# EAGLE design Nano-CC-EL_0v6.2_ENP252-17 (EAGLE 7.3.0)
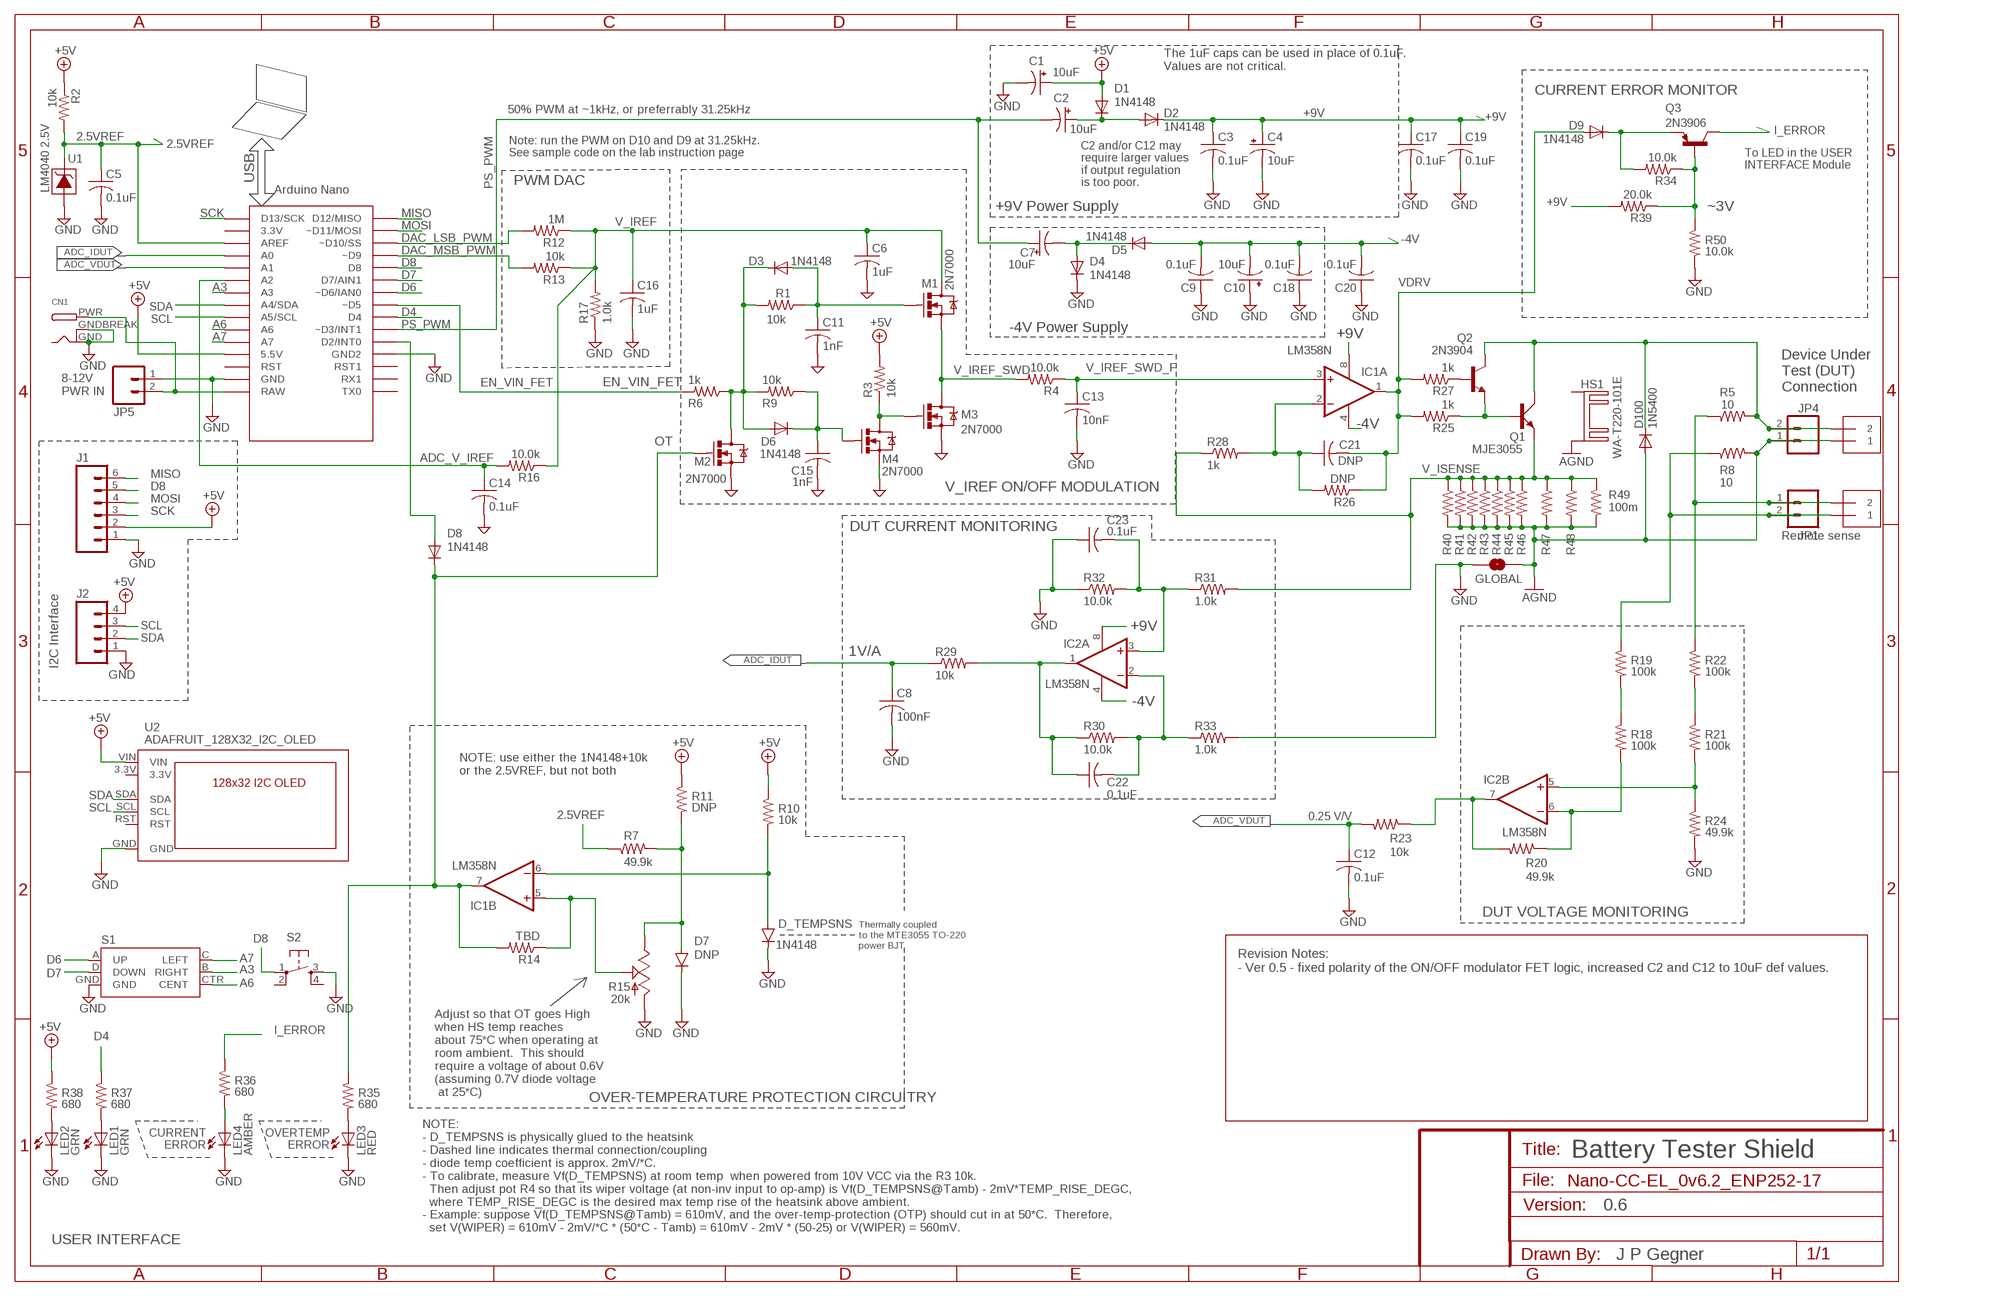
[diagram p0: schematic, sheet 1]

## Parts
C1  10uF  CPOL-USE5-5  [E5-5]
C2  10uF  CPOL-USE5-5  [E5-5]
C3  0.1uF  C-US025-025X050  [C025-025X050]
C4  10uF  CPOL-USE5-5  [E5-5]
C5  0.1uF  C-US025-025X050  [C025-025X050]
C6  1uF  C-US025-025X050  [C025-025X050]
C7  10uF  CPOL-USE5-5  [E5-5]
C8  100nF  C-US025-024X044  [C025-024X044]
C9  0.1uF  C-US025-025X050  [C025-025X050]
C10  10uF  CPOL-USE5-5  [E5-5]
C11  1nF  C-US025-025X050  [C025-025X050]
C12  0.1uF  C-US025-025X050  [C025-025X050]
C13  10nF  C-US025-025X050  [C025-025X050]
C14  0.1uF  C-US025-025X050  [C025-025X050]
C15  1nF  C-US025-025X050  [C025-025X050]
C16  1uF  C-US025-025X050  [C025-025X050]
C17  0.1uF  C-US025-025X050  [C025-025X050]
C18  0.1uF  C-US025-025X050  [C025-025X050]
C19  0.1uF  C-US025-025X050  [C025-025X050]
C20  0.1uF  C-US025-025X050  [C025-025X050]
C21  DNP  C-US025-025X050  [C025-025X050]
C22  0.1uF  C-US025-025X050  [C025-025X050]
C23  0.1uF  C-US025-025X050  [C025-025X050]
CN1  DCBARRELPTH  [DCJACK_2MM_PTH]
D1  1N4148  [0207/2V-D]
D2  1N4148  [0207/2V-D]
D3  1N4148  [0207/2V-D]
D4  1N4148  [0207/2V-D]
D5  1N4148  [0207/2V-D]
D6  1N4148  [0207/2V-D]
D7  DNP  1N4148  [0207/2V-D]
D8  1N4148  [0207/2V-D]
D9  1N4148  [0207/2V-D]
D100  1N5400  [DO201-15]
D_TEMPSNS  1N4148  [0207/2V-D]
GLOBAL  JUMPER-PAD-2-NC_BY_TRACENO_SILK  [PAD-JUMPER-2-NC_BY_TRACE_NO_SILK]
HS1  WA-T220-101E  [WX-T220-101E]
IC1  LM358N  [DIL08]
IC2  LM358N  [DIL08]
J1  M06POLAR  [MOLEX-1X6]
J2  M04LOCK_LONGPADS  [1X04_LOCK_LONGPADS]
JP1  M02PTH  [1X02]
JP2  1X2-3.5MM  [1X2-3.5MM]
JP3  1X2-3.5MM  [1X2-3.5MM]
JP4  M02PTH  [1X02]
JP5  M02PTH  [1X02]
LED1  GRN  LED-3MM-NO_SILK  [LED3MM-NS]
LED2  GRN  LED-3MM-NO_SILK  [LED3MM-NS]
LED3  RED  LED-3MM-NO_SILK  [LED3MM-NS]
LED4  AMBER  LED-3MM-NO_SILK  [LED3MM-NS]
M1  2N7000  MOSFET-NCHANNEL2N7000  [TO-92]
M2  2N7000  MOSFET-NCHANNEL2N7000  [TO-92]
M3  2N7000  MOSFET-NCHANNEL2N7000  [TO-92]
M4  2N7000  MOSFET-NCHANNEL2N7000  [TO-92]
Q1  MJE3055  [TO220AV]
Q2  2N3904  [TO92]
Q3  2N3906  [TO92]
R1  10k  R-US_0204/7  [0204/7]
R2  10k  R-US_0204/7  [0204/7]
R3  10k  R-US_0204/7  [0204/7]
R4  10.0k  R-US_0204/2V  [0204V]
R5  10  R-US_0204/2V  [0204V]
R6  1k  R-US_0204/2V  [0204V]
R7  49.9k  R-US_0204/7  [0204/7]
R8  10  R-US_0204/2V  [0204V]
R9  10k  R-US_0204/7  [0204/7]
R10  10k  R-US_0204/7  [0204/7]
R11  DNP  R-US_0204/7  [0204/7]
R12  1M  R-US_0204/7  [0204/7]
R13  10k  R-US_0204/7  [0204/7]
R14  TBD  R-US_0204/7  [0204/7]
R15  20k  TRIM_US-B64Y  [B64Y]
R16  10.0k  R-US_0204/7  [0204/7]
R17  1.0k  R-US_0204/7  [0204/7]
R18  100k  R-US_0204/7  [0204/7]
R19  100k  R-US_0204/7  [0204/7]
R20  49.9k  R-US_0204/2V  [0204V]
R21  100k  R-US_0204/7  [0204/7]
R22  100k  R-US_0204/7  [0204/7]
R23  10k  R-US_0204/7  [0204/7]
R24  49.9k  R-US_0204/7  [0204/7]
R25  1k  R-US_0204/7  [0204/7]
R26  DNP  R-US_0204/2V  [0204V]
R27  1k  R-US_0204/7  [0204/7]
R28  1k  R-US_0204/7  [0204/7]
R29  10k  R-US_0204/7  [0204/7]
R30  10.0k  R-US_0204/2V  [0204V]
R31  1.0k  R-US_0204/7  [0204/7]
R32  10.0k  R-US_0204/7  [0204/7]
R33  1.0k  R-US_0204/7  [0204/7]
R34  10.0k  R-US_0204/7  [0204/7]
R35  680  R-US_0204/7  [0204/7]
R36  680  R-US_0204/7  [0204/7]
R37  680  R-US_0207/15  [0207/15]
R38  680  R-US_0204/7  [0204/7]
R39  20.0k  R-US_0204/7  [0204/7]
R40  100m  R-US_0204/7  [0204/7]
R41  100m  R-US_0204/7  [0204/7]
R42  100m  R-US_0204/7  [0204/7]
R43  100m  R-US_0204/7  [0204/7]
R44  100m  R-US_0204/7  [0204/7]
R45  100m  R-US_0204/7  [0204/7]
R46  100m  R-US_0204/7  [0204/7]
R47  100m  R-US_0204/7  [0204/7]
R48  100m  R-US_0204/7  [0204/7]
R49  100m  R-US_0204/7  [0204/7]
R50  10.0k  R-US_0204/7  [0204/7]
S1  JOYSTICK_MINI  [JOYSTICK_MINI]
S2  E-SWITCH_TL1105L-F250-Q  [OMRON_B3F-1XX-JPGMOD]
U1  LM4040 2.5V  LM4040TO92  [TO92]
U2  ADAFRUIT_128X32_I2C_OLED  [ADAFRUIT_128X32_I2C_OLED]
U$1  NANO  [NANO]

## Nets
2.5VREF: C5.1 R2.2 R7.1 U1.2(CATHODE) U$1.AREF
+5V: C1.+ D1.A J1.2 J2.4 R2.1 R3.2 R10.1 R11.1 R38.1 U2.VIN U$1.5V(5.5V)
+9V: C3.1 C4.+ C17.1 C19.1 D2.K(C) IC1.8(P:V+) IC2.8(P:V+) R39.2
-4V: C9.2 C10.- C18.2 C20.2 D5.A IC1.4(P:V-) IC2.4(P:V-)
A3: S1.B(RIGHT) U$1.A3
A6: S1.CTR(CENT) U$1.A6
A7: S1.C(LEFT) U$1.A7
ADC_IDUT: C8.1 R29.1 U$1.A0
ADC_V_IREF: C14.1 R16.2 U$1.A2
ADC_VDUT: C12.1 R23.2 U$1.A1
AGND: D100.A GLOBAL.2 HS1.K2(K) JP3.1 JP4.1 R8.2 R40.2 R41.2 R42.2 R43.2 R44.2 R45.2 R46.2 R47.2 R48.2 R49.2
D4: R37.1 U$1.D4
D6: S1.A(UP) U$1.D6(~D6/IAN0)
D7: S1.D(DOWN) U$1.D7(D7/AIN1)
D8: J1.5 S2.1(P) U$1.D8
DAC_LSB_PWM: R12.2 U$1.D10(~D10/SS)
DAC_MSB_PWM: R13.2 U$1.D9(~D9)
EN_VIN_FET: R6.2 U$1.D5(~D5)
EN_VIN_FETX: D3.K(C) D6.A M2.3(D) R1.2 R6.1 R9.2
GND: C1.- C3.2 C4.- C5.2 C6.2 C8.2 C9.1 C10.+ C11.2 C12.2 C13.2 C14.2 C15.2 C16.2 C17.2 C18.1 C19.2 C20.1 C23.1 CN1.GND CN1.GNDBREAK D4.K(C) D7.K(C) D_TEMPSNS.K(C) GLOBAL.1 J1.1 J2.1 JP5.1 LED1.K(C) LED2.K(C) LED3.K(C) LED4.K(C) M2.1(S) M3.1(S) M4.1(S) R15.A R17.1 R24.2 R32.1 R33.2 R50.2 S1.GND S2.3(S) U1.3(ANODE) U2.GND U$1.GND U$1.GND1(GND2)
I_ERROR: Q3.1(C) R36.1
MISO: J1.6 U$1.D12(D12/MISO)
MOSI: J1.4 U$1.D11(~D11/MOSI)
N$1: D7.A R7.2 R11.2 R15.E
N$2: R21.1 R22.2
N$3: C23.2 IC2.3(A:+IN) R31.1 R32.2
N$4: C22.2 IC2.2(A:-IN) R30.2 R33.1
N$5: D_TEMPSNS.A IC1.6(B:-IN) R10.2
N$6: IC1.5(B:+IN) R14.1 R15.S
N$8: C11.1 D3.A M1.2(G) R1.1
N$9: D9.K(C) Q3.3(E) R34.2
N$10: IC2.6(B:-IN) R18.2 R20.1
N$11: C7.- D4.A D5.K(C)
N$12: LED3.A R35.2
N$13: LED2.A R38.2
N$14: LED1.A R37.2
N$15: C22.1 IC2.1(A:OUT) R29.2 R30.1
N$16: LED4.A R36.2
N$17: Q3.2(B) R34.1 R39.1 R50.1
N$18: C2.+ D1.K(C) D2.A
N$19: IC2.5(B:+IN) R21.2 R24.1
N$20: C15.1 D6.K(C) M4.2(G) R9.1
N$21: M3.2(G) M4.3(D) R3.1
N$22: JP1.1 JP2.2 R5.1 R22.1
N$23: D8.A U$1.D2(D2/INT0)
N$24: Q2.2(B) R27.1
N$25: D100.C JP3.2 JP4.2 Q1.C Q2.1(C) R5.2
N$26: Q1.B Q2.3(E) R25.1
N$27: R18.1 R19.2
N$28: C21.1 IC1.2(A:-IN) R26.2 R28.2
N$29: JP1.2 JP2.1 R8.1 R19.1
OT: D8.K(C) IC1.7(B:OUT) M2.2(G) R14.2 R35.1
PS_PWM: C2.- C7.+ U$1.D3(~D3/INT1)
RAW: CN1.PWR JP5.2 U$1.RAW
SCK: J1.3 U$1.D13(D13/SCK)
SCL: J2.3 U2.SCL U$1.A5(A5/SCL)
SDA: J2.2 U2.SDA U$1.A4(A4/SDA)
V_IREF: C6.1 C16.1 M1.3(D) R12.1 R13.1 R16.1 R17.2
V_IREF_SWD: M1.1(S) M3.3(D) R4.2
V_IREF_SWD_F: C13.1 IC1.3(A:+IN) R4.1
V_ISENSE: Q1.E R28.1 R31.2 R40.1 R41.1 R42.1 R43.1 R44.1 R45.1 R46.1 R47.1 R48.1 R49.1
VDRV: C21.2 D9.A IC1.1(A:OUT) R25.2 R26.1 R27.2
VDUT_OP: IC2.7(B:OUT) R20.2 R23.1
Unconnected: HS1.K1(K) S2.2(P1) S2.4(S1) U2.RST U$1.3.3V U$1.ICSP1 U$1.ICSP2 U$1.ICSP3 U$1.ICSP4 U$1.ICSP5 U$1.ICSP6 U$1.RST U$1.RST1 U$1.RX1 U$1.TX0

## Notes on the sheet
- The 1uF caps can be used in place of 0.1uF.
  Values are not critical.
- CURRENT ERROR MONITOR
- 50% PWM at ~1kHz, or preferrably 31.25kHz
- Note: run the PWM on D10 and D9 at 31.25kHz.  
  See sample code on the lab instruction page
- To LED in the USER
  INTERFACE Module
- USB | PWM DAC
- C2 and/or C12 may
  require larger values
  if output regulation
  is too poor.
- +9V Power Supply | ~3V
- -4V Power Supply
- Device Under
  Test (DUT)
  Connection
- 8-12V
  PWR IN
- V_IREF ON/OFF MODULATION
- DUT CURRENT MONITORING
- Remote sense
- 1V/A
- I2C Interface
- NOTE: use either the 1N4148+10k
  or the 2.5VREF, but not both
- 0.25 V/V
- DUT VOLTAGE MONITORING
- Thermally coupled
  to the MTE3055 TO-220 
  power BJT
- Revision Notes:
  - Ver 0.5 - fixed polarity of the ON/OFF modulator FET logic, increased C2 and C12 to 10uF def values.
- Adjust so that OT goes High
  when HS temp reaches
  about 75*C when operating at 
  room ambient.  This should
  require a voltage of about 0.6V
  (assuming 0.7V diode voltage
   at 25*C)
- OVER-TEMPERATURE PROTECTION CIRCUITRY
- CURRENT
  ERROR
- OVERTEMP
  ERROR
- Battery Tester Shield
- 0.6
- NOTE:
  - D_TEMPSNS is physically glued to the heatsink
  - Dashed line indicates thermal connection/coupling
  - diode temp coefficient is approx. 2mV/*C.
  - To calibrate, measure Vf(D_TEMPSNS) at room temp  when powered from 10V VCC via the R3 10k.
    Then adjust pot R4 so that its wiper voltage (at non-inv input to op-amp) is Vf(D_TEMPSNS@Tamb) - 2mV*TEMP_RISE_DEGC,
    where TEMP_RISE_DEGC is the desired max temp rise of the heatsink above ambient.  
  - Example: suppose Vf(D_TEMPSNS@Tamb) = 610mV, and the over-temp-protection (OTP) should cut in at 50*C.  Therefore,
    set V(WIPER) = 610mV - 2mV/*C * (50*C - Tamb) = 610mV - 2mV * (50-25) or V(WIPER) = 560mV.
- USER INTERFACE
- J P Gegner

## Power pins joined to a net without a drawn wire
3.3V: U2.3.3V

## Library data of the parts
C1 C2 C4 C7 C10 = rcl:CPOL-US: POLARIZED CAPACITOR, American symbol
C3 C5 C6 C8 C9 C11-C23 = rcl:C-US: CAPACITOR, American symbol
CN1 = adafruit:DCBARREL: 2.0mm DC Barrel Jack DCJACK_2MM_PTH - Through Hole Jack (4UConnector: 05537)
D1-D6 D8 D9 = JPG_17v2:1N4148
D7 D_TEMPSNS = ideal_elements:1N4148
D100 = diode:1N5400: DIODE standard rectifier, 3 A, 50 V (Motorola)
GLOBAL = SparkFun-Passives:JUMPER-PAD-2-NC_BY_TRACE
HS1 = JPG_17v2:WA-T220-101E: Ohmite W series Heatsink for TO-220, 12 degC/W natural convection at 10W WA-T220-101E WV-T220-101E see also a T247 version
IC1 IC2 = linear:LM358: OP AMP also LM158; LM258; LM2904 Source: http://cache.national.com/ds/LM/LM158.pdf
J1 = JPG_17v2:M06: Header 6 Standard 6-pin 0.1" header. Use with straight break away headers (SKU : PRT-00116), right angle break away headers (PRT-00553), swiss pins (PRT-00743), machine pins (PRT-00117), and female headers (PRT-00115). Molex polarized connector foot print use with SKU : PRT-08094 with associated crimp pins and housings. NOTES ON THE VARIANTS LOCK and LOCK_LONGPADS... This footprint was designed to help hold the alignment of a through-hole component (i.e. 6-pin header) while soldering it into place. You may notice that each hole has been shifted either up or down by 0.005 of an inch from it's more standard position (which is a perfectly straight line). This slight alteration caused the pins (the squares in the middle) to touch the edges of the holes. Because they are alternating, it causes a "brace" to hold the component in place. 0.005 has proven to be the perfect amount of "off-center" position when using our standard breakaway headers. Although looks a little odd when you look at the bare footprint, once you have a header in there, the alteration is very hard to notice. Also,if you push a header all the way into place, it is covered up entirely on the bottom side. This idea of altering the position of holes to aid alignment will be further integrated into the Sparkfun Library for other footprints. It can help hold any component with 3 or more connection pins.
J2 = JPG_17v2:M04: Header 4 Standard 4-pin 0.1" header. Use with straight break away headers (SKU : PRT-00116), right angle break away headers (PRT-00553), swiss pins (PRT-00743), machine pins (PRT-00117), and female headers (PRT-00115). Molex polarized connector foot print use with SKU : PRT-08231 with associated crimp pins and housings. 1MM SMD Version SKU: PRT-10208; PROD_ID: CONN-09696
JP1 JP4 JP5 = JPG_17v1:M02: Header 2 Standard 2-pin 0.1" header. Use with straight break away headers (SKU : PRT-00116), right angle break away headers (PRT-00553), swiss pins (PRT-00743), machine pins (PRT-00117), and female headers (PRT-00115). Molex polarized connector foot print use with SKU : PRT-08233 with associated crimp pins and housings.
JP2 JP3 = adafruit:1X2: 3.5mm Terminal block http://www.ladyada.net/library/pcb/eaglelibrary.html
LED1-LED4 = JPG_17v2:LED: LEDs Standard schematic elements and footprints for 5mm, 3mm, 1206, and 0603 sized LEDs. 5mm - Spark Fun Electronics SKU : COM-00529 (and others)
M1-M4 = SparkFun-DiscreteSemi:MOSFET-NCHANNEL: Common NMOSFET Parts MFG P/N Store ID Prod ID FDD8780 TRANS-09984 SI7820DN TRANS-11055 FDS6630A IC-08089 2N7002PW TRANS-11151 FQP30N06L COM-10213 TRANS-10060 BSS123LT1G TRANS-08345 BSS138 TRANS-00830 BS170 2N7000
Q1 = transistor-power:MJE3055: NPN TRANSISTOR
Q2 = transistor:2N3904: NPN TRANSISTOR
Q3 = transistor-pnp:2N3906: PNP Transistor
R1-R14 R16-R50 = rcl:R-US_: RESISTOR, American symbol
R15 = JPG_17v1:TRIM_US-: POTENTIOMETER
S1 = SparkFun-Electromechanical:JOYSTICK_MINI: Small 5-way tactile joystick, COM-10063 4UCON SF303GJ26; PROD_ID: SWCH-09905
S2 = ideal_elements:E-SWITCH_TL1105L-F250-Q: PC MOUNT TACTILE MOMENTARY SWITCH (LOW COST, MOUSER)
U1 = JPG_17v1:LM4040
U2 = JPG_17v2:ADAFRUIT_128X32_I2C_OLED: ADAFRUIT 128x32 I2C OLED display, 3.3V or 5V input http://www.adafruit.com/products/931
U$1 = Arduino-clone:NANO: Arduino Nano

## Board
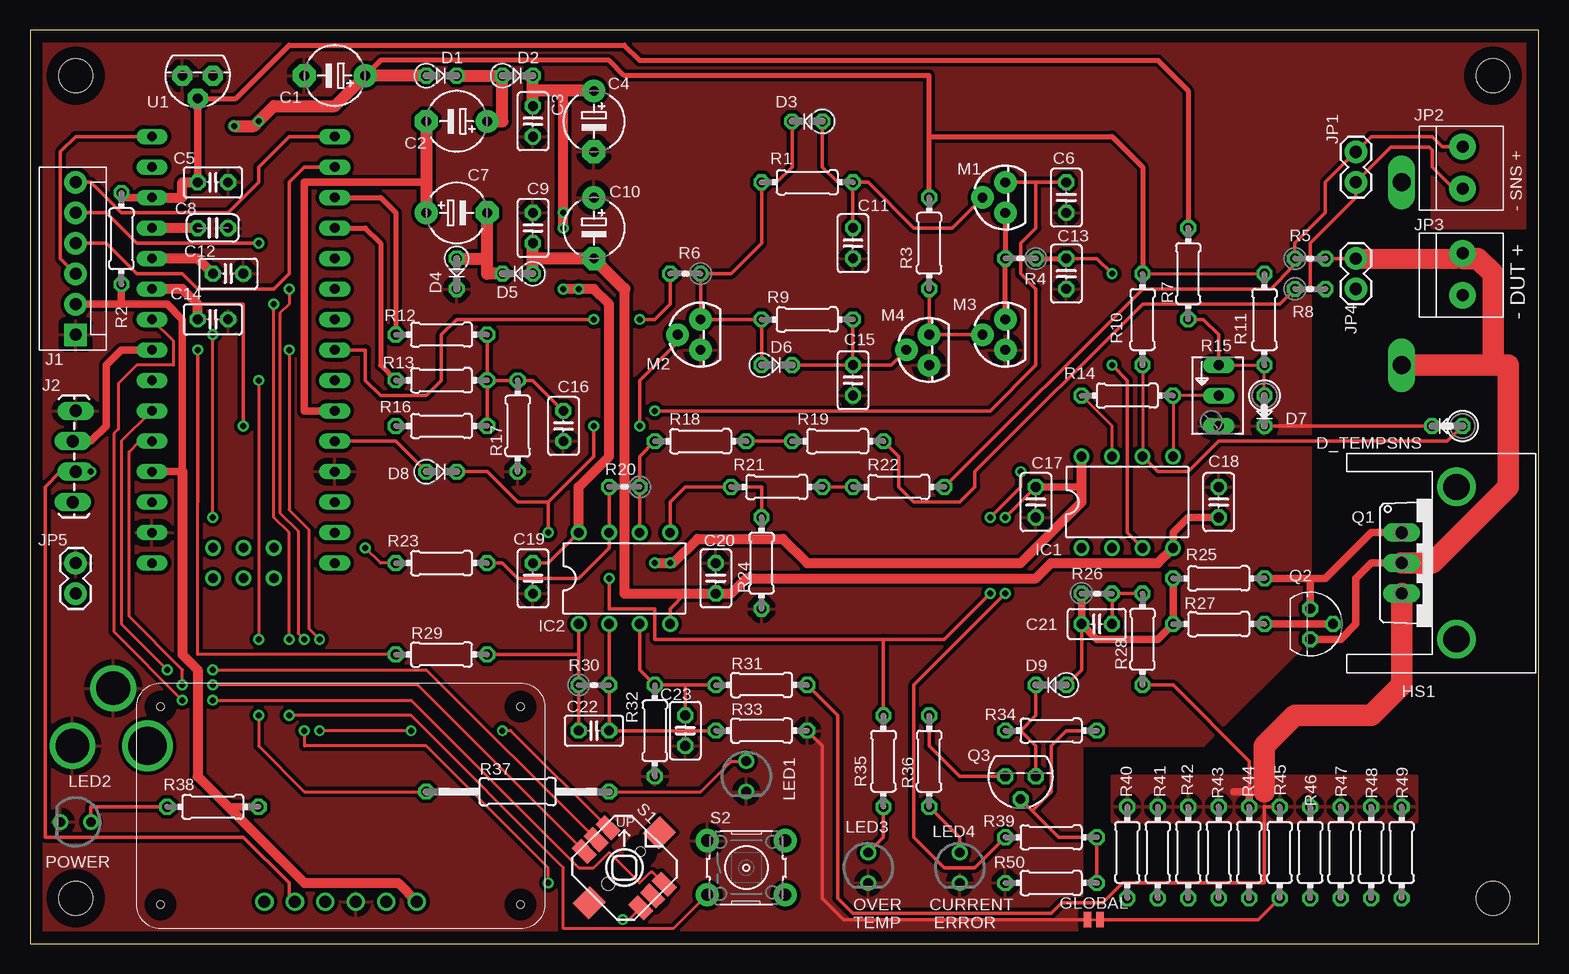
[diagram p1: board, top side]
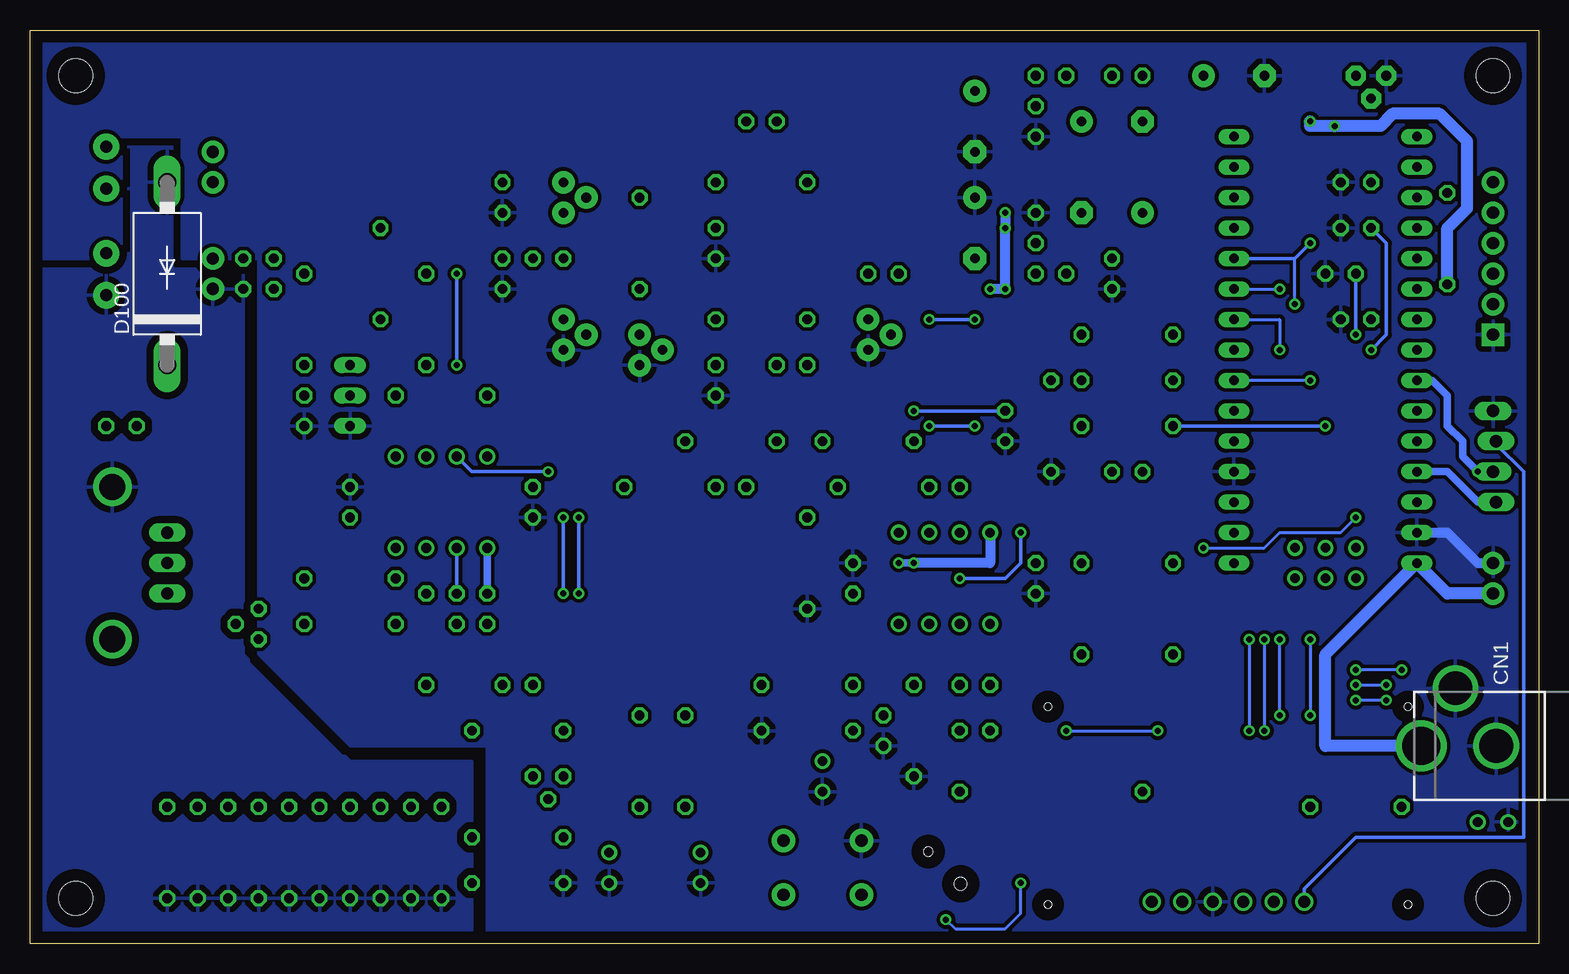
[diagram p2: board, bottom side, seen from below]

Size 125.73 x 76.2 mm. Coordinates in mm from the lower left corner, seen from the top.
Outline: 0,0 125.73,0 125.73,76.2 0,76.2 0,0
Copper layers (1*16): Top 0.035mm / dielectric 1.5mm / Bottom 0.035mm
Design rules "4pcb_$33": minimum track width 6mil, minimum drill 15mil, track to track 6mil, track to pad 6mil, pad to pad 6mil, via to via 6mil, smd to smd 6mil, copper to edge 40mil, drill to drill 6mil, minimum pad ring 10mil, minimum via ring 8mil, stop-mask expansion 4mil, vias tented up to drill 0mil, thermal gap 20mil
Holes 2.79 mm at 3.81,3.81 3.81,72.39 121.92,3.81 121.92,72.39

### Footprints (pad centres in the part's own frame; a part is rotated, then mirrored left to right if it is on the bottom)
E5-5 = drill 0.813 pad 1.905: + -2.54,0 | drill 0.813 pad 1.905 octagon: - 2.54,0
C025-025X050 = drill 0.813 octagon: 1 -1.27,0; 2 1.27,0
C025-024X044 = drill 0.813 octagon: 1 -1.27,0; 2 1.27,0
DCJACK_2MM_PTH = drill 2.8: GND 0,7.35; GNDBREAK 4.8,10.75 | drill 3.2: PWR 0,13.6
0207/2V-D = drill 0.813 octagon: A -1.27,0; K 1.27,0
DO201-15 = drill 1.499 long: A 7.62,0; C -7.62,0
PAD-JUMPER-2-NC_BY_TRACE_NO_SILK = smd 0.635 x 1.27: 1 -0.508,0; 2 0.508,0
WX-T220-101E = drill 2.2 pad 3.175: K1 -6.35,-4.572; K2 6.35,-4.572
DIL08 = drill 0.813 pad 1.27: 1 -3.81,-3.81; 2 -1.27,-3.81; 3 1.27,-3.81; 4 3.81,-3.81; 5 3.81,3.81; 6 1.27,3.81; 7 -1.27,3.81; 8 -3.81,3.81
MOLEX-1X6 = drill 1.016 pad 1.88 square: 1 0,0 | drill 1.016 pad 1.88: 2 2.54,0; 3 5.08,0; 4 7.62,0; 5 10.16,0; 6 12.7,0
1X04_LOCK_LONGPADS = drill 1.016 long: 1 0,0; 2 2.54,-0.254; 3 5.08,0; 4 7.62,-0.254
1X02 = drill 1.016 pad 1.88: 1 0,0; 2 2.54,0
1X2-3.5MM = drill 1 pad 2.184: 1 1.8,0; 2 -1.7,0
LED3MM-NS = drill 0.813: A -1.27,0; K 1.27,0
TO-92 = drill 0.813 pad 1.88: 1 -1.27,0; 2 0,1.905; 3 1.27,0
TO220AV = drill 1.016 long: B -2.54,-2.54; C 0,-2.54; E 2.54,-2.54
TO92 = drill 0.813 octagon: 1 1.27,0; 2 0,1.905; 3 -1.27,0
0204/7 = drill 0.813 octagon: 1 -3.81,0; 2 3.81,0
0204V = drill 0.813 octagon: 1 -1.27,0; 2 1.27,0
B64Y = drill 0.813 long: A 2.54,0; E -2.54,0; S 0,0
0207/15 = drill 0.813 octagon: 1 -7.62,0; 2 7.62,0
JOYSTICK_MINI = smd 1.85 x 1.1: A -3.325,1.4; B 3.325,1.4; C -3.325,-1.4; CTR -3.325,0; D 3.325,-1.4; GND 3.325,0 | smd 1.9 x 2: NC 0,4.13; NC@0 0,-4.13 | hole 0.75: 0,1.9 | hole 1.05: 0,-1.9
OMRON_B3F-1XX-JPGMOD = drill 1.016 pad 1.93: 1 -3.251,-2.261; 2 3.251,-2.261; 3 -3.251,2.261; 4 3.251,2.261
TO92' = drill 0.813 pad 1.676 octagon: 1 -1.27,0; 2 0,1.905; 3 1.27,0
ADAFRUIT_128X32_I2C_OLED = drill 1: 3.3V 20.81,2.254; GND 18.27,2.254; RST 15.73,2.254; SCL 13.19,2.254; SDA 10.65,2.254; VIN 23.35,2.254 | hole 0.6: 2,2; 2,18.5; 32,18.5; 32,2
NANO = drill 0.8 long: 3.3V -10.16,24.13; 5V -10.16,-1.27; A0 -10.16,19.05; A1 -10.16,16.51; A2 -10.16,13.97; A3 -10.16,11.43; A4 -10.16,8.89; A5 -10.16,6.35; A6 -10.16,3.81; A7 -10.16,1.27; AREF -10.16,21.59; D2 5.08,1.27; D3 5.08,3.81; D4 5.08,6.35; D5 5.08,8.89; D6 5.08,11.43; D7 5.08,13.97; D8 5.08,16.51; D9 5.08,19.05; D10 5.08,21.59; D11 5.08,24.13; D12 5.08,26.67; D13 -10.16,26.67; GND -10.16,-6.35; GND1 5.08,-1.27; RAW -10.16,-8.89; RST -10.16,-3.81; RST1 5.08,-3.81; RX1 5.08,-6.35; TX0 5.08,-8.89 | drill 0.8: ICSP1 -5.08,-10.16; ICSP2 -5.08,-7.62; ICSP3 -2.54,-10.16; ICSP4 -2.54,-7.62; ICSP5 0,-10.16; ICSP6 0,-7.62

### Placement (x,y rotation side)
C1  25.4,72.39 180 top
C2  35.56,68.58 180 top
C3  41.91,68.58 270 top
C4  46.99,68.58 270 top
C5  15.24,63.5 0 top
C6  86.36,62.23 270 top
C7  35.56,60.96 0 top
C8  15.24,59.69 0 top
C9  41.91,59.69 270 top
C10  46.99,59.69 270 top
C11  68.58,58.42 270 top
C12  16.51,55.88 0 top
C13  86.36,55.88 270 top
C14  15.24,52.07 0 top
C15  68.58,46.99 270 top
C16  44.45,43.18 270 top
C17  83.82,36.83 270 top
C18  99.06,36.83 270 top
C19  41.91,30.48 270 top
C20  57.15,30.48 270 top
C21  88.9,26.67 180 top
C22  46.99,17.78 0 top
C23  54.61,17.78 90 top
CN1  -3.81,16.51 90 bottom
D1  34.29,72.39 0 top
D2  40.64,72.39 0 top
D3  64.77,68.58 180 top
D4  35.56,55.88 270 top
D5  40.64,55.88 180 top
D6  62.23,48.26 0 top
D7  102.87,44.45 270 top
D8  34.29,39.37 0 top
D9  85.09,21.59 180 top
D100  114.3,55.88 90 bottom
D_TEMPSNS  118.11,43.18 180 top
GLOBAL  88.65,2.03 0 top
HS1  114.3,31.75 90 top
IC1  91.44,36.83 0 top
IC2  49.53,30.48 0 top
J1  3.81,50.8 90 top
J2  3.81,44.45 270 top
JP1  110.49,66.04 270 top
JP2  119.38,64.77 270 top
JP3  119.38,55.88 270 top
JP4  110.49,54.61 90 top
JP5  3.81,31.75 270 top
LED1  59.69,13.97 270 top
LED2  3.81,10.16 180 top
LED3  69.85,6.35 270 top
LED4  77.47,6.35 270 top
M1  81.28,62.23 90 top
M2  55.88,50.8 90 top
M3  81.28,50.8 90 top
M4  74.93,49.53 90 top
Q1  116.84,31.75 270 top
Q2  106.68,26.67 270 top
Q3  82.55,13.97 180 top
R1  64.77,63.5 180 top
R2  7.62,58.8 90 top
R3  74.93,58.42 90 top
R4  82.55,57.15 180 top
R5  106.68,57.15 0 top
R6  54.61,55.88 180 top
R7  96.52,55.88 270 top
R8  106.68,54.61 0 top
R9  64.77,52.07 180 top
R10  92.71,52.07 270 top
R11  102.87,52.07 270 top
R12  34.29,50.8 180 top
R13  34.29,46.99 180 top
R14  91.44,45.72 180 top
R15  99.06,45.72 270 top
R16  34.29,43.18 180 top
R17  40.64,43.18 90 top
R18  55.88,41.91 180 top
R19  67.31,41.91 180 top
R20  49.53,38.1 180 top
R21  62.23,38.1 180 top
R22  72.39,38.1 180 top
R23  34.29,31.75 180 top
R24  60.96,31.75 270 top
R25  99.06,30.48 180 top
R26  88.9,29.21 0 top
R27  99.06,26.67 180 top
R28  92.71,25.4 90 top
R29  34.29,24.13 0 top
R30  46.99,21.59 0 top
R31  60.96,21.59 0 top
R32  52.07,17.78 90 top
R33  60.96,17.78 0 top
R34  85.09,17.78 180 top
R35  71.12,15.24 270 top
R36  74.93,15.24 270 top
R37  40.64,12.7 0 top
R38  15.24,11.43 180 top
R39  85.09,8.89 180 top
R40  91.44,7.62 270 top
R41  93.98,7.62 270 top
R42  96.52,7.62 270 top
R43  99.06,7.62 270 top
R44  101.6,7.62 270 top
R45  104.14,7.62 270 top
R46  106.68,7.62 270 top
R47  109.22,7.62 270 top
R48  111.76,7.62 270 top
R49  114.3,7.62 270 top
R50  85.09,5.08 180 top
S1  49.53,6.35 315 top
S2  59.69,6.35 0 top
U1  LM4040 2.5V  [TO92']  13.97,72.39 180 top
U2  8.89,1.27 0 top
U$1  20.32,40.64 0 top

### Tracks (layer width: path | path; a pad name or v marks a point on that pad's centre or on a via)
2.5VREF
  Top 0.406: U1.2 17.14,70.48 21.59,74.93 49.53,74.93 50.8,73.66 93.98,73.66 96.52,71.12 R7.1
  Top 0.61: U1.2 C5.1 | U$1.AREF 8,62.23 R2.2
  Top 0.813: C5.1 12.7,63.5 12.7,62.23 U$1.AREF
+5V  (via drill 0.5)
  Top 0.254: R10.1 R11.1
  Top 0.406: R3.2 74.93,67.31 | 74.93,67.31 74.93,72.39 49.53,72.39 48.26,73.66 29.21,73.66 C1.+ | 74.93,67.31 90.17,67.31 92.71,64.77 R10.1
  Top 0.61: J1.2 7.62,53.34 | 7.62,53.34 11.43,53.34 12.7,52.07 12.7,39.37 U$1.5V | R2.1 7.62,53.34 | R38.1 16.51,11.43
  Top 0.813: 12.7,39.37 12.7,24.13 13.97,22.86 13.97,13.97 16.51,11.43 22.86,5.08 30.68,5.08 U2.VIN
  Top 1.016: D1.A C1.+ 25.4,69.85 20.32,69.85 v19.05,68.58 18.67,68.2 v17.02,68.2
  Bottom 0.61: U$1.5V 7.62,39.37 5.08,36.83 J2.4
  Bottom 1.016: R2.1 7.62,59.69 5.97,61.34 5.97,66.93 8.26,69.22 12.19,69.22 13.21,68.2 v17.02,68.2 19.05,68.2 v19.05,68.58
+9V  (via drill 0.5)
  Top 0.305: R39.2 78.74,6.35 76.2,6.35 73.66,8.89 73.66,21.59 v81.28,29.21 | v81.28,35.56 C17.1 | C19.1 43.18,31.75 IC2.8
  Top 0.61: C17.1 87.63,38.1 | 87.63,39.37 IC1.8
  Top 0.813: IC2.8 45.72,38.1 48.26,40.64 48.26,53.34 46.99,54.61 v45.72,54.61 v44.45,54.61 | v44.45,59.69 v44.45,60.96 44.45,71.12 | v52.07,31.75 v53.34,31.75 53.59,31.75 55.63,33.78 62.74,33.78 64.77,31.75 82.55,31.75 87.63,36.83 87.63,38.1 IC1.8
  Top 1.016: C3.1 41.91,71.12 | 41.91,71.12 D2.K | C4.+ 44.45,71.12 41.91,71.12
  Bottom 0.305: v81.28,29.21 v81.28,35.56
  Bottom 0.61: v52.07,31.75 v53.34,31.75
  Bottom 0.813: v44.45,60.96 v44.45,59.69 v44.45,54.61 v45.72,54.61 | IC2.8 45.72,31.75 v52.07,31.75
-4V
  Top 0.305: IC2.4 53.34,27.94 54.61,29.21 C20.2
  Top 0.61: C18.2 96.52,35.56 95.25,34.29 IC1.4
  Top 0.813: 49.53,54.61 49.53,29.21 C20.2 58.42,29.21 59.69,30.48 83.82,30.48 85.09,31.75 93.98,31.75 IC1.4
  Top 1.016: 49.53,54.61 C10.- 41.91,57.15 | D5.A 41.91,57.15 | 41.91,57.15 C9.2
A3  (via drill 0.5)
  Top 0.254: U$1.A3 11.94,50.29 11.94,48.26 8.89,48.26 7.37,46.74 7.37,42.93 6.99,42.55 6.99,26.04 v12.7,20.32 | v15.24,20.32 31.75,20.32 45.72,6.35 46.99,6.35 48.26,7.62 50.8,5.08 51.69,5.97 51.89,5.97 S1.B
  Bottom 0.254: v12.7,20.32 v15.24,20.32
A6  (via drill 0.5)
  Top 0.254: v11.43,22.86 7.62,26.67 7.62,41.91 U$1.A6 | v15.24,22.86 33.02,22.86 S1.CTR
  Top 0.305: S1.CTR
  Bottom 0.254: v11.43,22.86 v15.24,22.86
A7  (via drill 0.5)
  Top 0.254: S1.C 32.31,21.59 v15.24,21.59 | U$1.A7 9.14,41.91 8.26,41.02 8.26,27.3 12.7,22.86 v12.7,21.59
  Bottom 0.254: v15.24,21.59 v12.7,21.59
ADC_IDUT  (via drill 0.5)
  Top 0.254: R29.1 13.97,24.13 13.97,36.83
  Top 0.305: 13.97,36.83 v13.97,49.53
  Top 0.813: C8.1 U$1.A0
  Bottom 0.305: v13.97,49.53 12.7,50.8 12.7,58.42 C8.1
ADC_V_IREF  (via drill 0.5)
  Top 0.305: v17.78,43.18 17.78,53.34 13.97,53.34
  Top 0.813: C14.1 13.97,53.34 12.7,54.61 U$1.A2
  Bottom 0.305: R16.2 v17.78,43.18
ADC_VDUT  (via drill 0.5)
  Top 0.254: R23.2 29.21,31.75 v27.94,33.02 | v15.24,35.56 v15.24,50.8
  Top 0.813: C12.1 13.97,57.15 U$1.A1
  Bottom 0.254: v27.94,33.02 22.86,33.02 21.59,34.29 16.51,34.29 v15.24,35.56
  Bottom 0.305: v15.24,50.8 C12.1
AGND
  Top 0.305: GLOBAL.2 102.36,2.03 R45.2
  pour Bottom (isolate 0.61, rank 2): 125.73,76.2 107.95,76.2 107.95,24.13 99.06,15.24 88.9,15.24 88.9,0 125.73,0
D4  (via drill 0.5)
  Top 0.254: v19.05,46.99 v19.05,25.4 | v19.05,19.05 19.05,16.51 22.86,12.7 R37.1
  Bottom 0.254: v19.05,46.99 U$1.D4 | v19.05,25.4 v19.05,19.05
D6  (via drill 0.5)
  Top 0.254: v21.59,49.53 21.59,36.2 23.24,34.54 23.24,26.29 v24.13,25.4 | S1.A 40.08,17.78 v39.37,17.78 | v31.75,17.78 v24.13,17.78
  Bottom 0.254: U$1.D6 21.59,52.07 v21.59,49.53 | v24.13,25.4 v24.13,17.78 | v39.37,17.78 v31.75,17.78
D7  (via drill 0.5)
  Top 0.254: v21.59,54.61 21.59,53.34 20.83,52.58 20.83,35.94 22.35,34.42 22.35,25.91 v22.86,25.4 | v22.86,17.78 22.86,16.51 33.02,16.51 43.18,6.35 v43.18,5.08 | S1.D 49.91,2.03 v49.4,2.03
  Bottom 0.254: U$1.D7 v21.59,54.61 | v22.86,25.4 v22.86,17.78 | v49.4,2.03 48.64,1.27 44.45,1.27 43.18,2.54 v43.18,5.08
D8  (via drill 0.5)
  Top 0.254: S2.1 53.62,1.27 44.45,1.27 44.45,6.35 31.75,19.05 v21.59,19.05 | v21.59,25.4 21.59,34.29 20.32,35.56 v20.32,53.34
  Top 0.305: v19.05,58.42 8.89,58.42 6.35,60.96 J1.5
  Bottom 0.254: v21.59,19.05 v21.59,25.4 | v20.32,53.34 20.32,57.15
  Bottom 0.305: U$1.D8 20.32,57.15 v19.05,58.42
DAC_LSB_PWM
  Top 0.406: U$1.D10 29.21,62.23 30.48,60.96 R12.2
DAC_MSB_PWM
  Top 0.406: U$1.D9 27.94,59.69 29.21,58.42 29.21,48.26 R13.2
EN_VIN_FET  (via drill 0.5)
  Top 0.305: U$1.D5 27.94,49.53 27.94,46.99 29.21,45.72 33.02,45.72 34.29,46.99 34.29,50.8 35.56,52.07 v46.99,52.07 | v50.8,52.07 52.07,52.07 53.34,53.34 R6.2
  Bottom 0.305: v46.99,52.07 v50.8,52.07
EN_VIN_FETX
  Top 0.305: D6.A R9.2 M2.3 R6.1 58.42,55.88 60.96,58.42 R1.2 62.23,63.5 63.5,64.77 D3.K
GND
  Top 0.305: GLOBAL.1 67.82,2.03 66.04,3.81 66.04,16.51 R33.2 | D_TEMPSNS.K D7.K
  Bottom 0.813: U$1.GND 7.62,34.29 5.08,31.75 JP5.1
  Bottom 1.016: CN1.GNDBREAK 6.94,19.91
  pour Top (isolate 0.305): 0,0 0,76.2 125.73,76.2 125.73,59.69 116.84,59.69 116.84,66.04 113.03,66.04 111.76,64.77 111.76,63.5 106.68,58.42 106.68,25.4 97.79,16.51 87.63,16.51 87.63,0
  pour Bottom (isolate 0.305): 0,76.2 125.73,76.2 125.73,57.15 118.11,57.15 118.11,66.04 118.11,67.31 113.03,67.31 113.03,57.15 106.68,57.15 106.68,24.13 99.06,16.51 87.63,16.51 87.63,0 0,0
I_ERROR
  Top 0.305: R36.1 74.93,16.51 77.47,13.97 Q3.1
MISO
  Top 0.305: J1.6 5.08,63.5 7.62,60.96 16.51,60.96 19.05,63.5 19.05,64.77 21.59,67.31 U$1.D12
MOSI
  Top 0.305: U$1.D11 22.86,64.77 21.59,63.5 21.59,55.88 20.32,54.61 13.97,54.61 12.7,55.88 8.89,55.88 6.35,58.42 J1.4
N$1
  Top 0.254: D7.A R11.2 R15.E
  Top 0.305: R7.2 97.79,52.07 99.06,50.8 R15.E
N$2
  Top 0.305: R21.1 R22.2
N$3
  Top 0.305: IC2.3 50.8,22.86 R32.2 54.61,21.59 | R31.1 54.61,21.59 | C23.2 54.61,21.59
N$4
  Top 0.305: IC2.2 R30.2 C22.2 R33.1
N$5
  Top 0.254: R10.2 IC1.6
  Top 0.305: D_TEMPSNS.A 118.11,41.91 99.06,41.91 96.52,39.37 93.98,39.37 IC1.6
N$6
  Top 0.254: IC1.5 R14.1 R15.S
N$8
  Top 0.305: D3.A 66.04,64.77 67.31,63.5 R1.1 | C11.1 R1.1 | R1.1 69.85,63.5 73.66,59.69 76.83,59.69 M1.2
N$9
  Top 0.305: Q3.3 83.82,16.51 82.55,17.78 | 82.55,17.78 R34.2 | D9.K 83.82,19.05 82.55,17.78
N$10
  Top 0.305: IC2.6 R20.1 50.8,40.64 R18.2
N$11
  Top 1.016: D5.K 38.1,55.88 38.1,57.15 | 38.1,57.15 C7.- | D4.A 38.1,57.15
N$12
  Top 0.305: R35.2 71.12,8.89 LED3.A
N$13
  Top 0.305: LED2.A 5.08,11.43 R38.2
N$14
  Top 0.254: R37.2 55.88,12.7 58.42,15.24 LED1.A
N$15
  Top 0.305: C22.1 R30.1 45.72,24.13 | 45.72,24.13 IC2.1 | R29.2 45.72,24.13
N$16
  Top 0.305: R36.2 77.47,8.89 LED4.A
N$17
  Top 0.305: R50.1 R39.1 85.72,8.89 83.5,11.11 | 83.5,11.11 Q3.2 | R34.1 86.36,17.78 85.09,16.51 85.09,12.7 83.5,11.11
N$18
  Top 1.016: C2.+ 39.37,68.58 D2.A D1.K
N$19
  Top 0.305: IC2.5 53.34,36.83 54.61,38.1 R21.2 60.96,38.1 R24.1
N$20
  Top 0.305: D6.K C15.1 | R9.1 C15.1 | C15.1 71.75,48.26 M4.2
N$21
  Top 0.305: R3.1 M4.3 M3.2
N$22
  Top 0.305: R22.1 92.71,54.61 103.38,54.61 105.28,56.52 105.28,57.02 R5.1 105.41,58.42 107.95,60.96 107.95,63.5 JP1.1 111.76,67.31 116.84,67.31 117.68,66.47 JP2.2
N$23
  Top 0.305: U$1.D2 30.48,41.91 D8.A
N$24
  Top 0.61: R27.1 Q2.2
N$25
  Top 0.305: R5.2 JP4.2
  Top 0.61: Q2.1 109.22,25.4 110.49,26.67 110.49,30.48 111.76,31.75 Q1.C
  Top 1.676: JP4.2 118.95,57.15 | 119.38,57.15 118.95,57.15 | 118.95,57.15 JP3.2
  Top 1.778: Q1.C 116.84,31.75 123.19,38.1 123.19,48.26 121.92,48.26 | 119.46,57.66 JP3.2 | D100.C 121.92,48.26 | 119.38,57.15 120.65,57.15 121.92,55.88 121.92,48.26
N$26
  Top 0.61: Q1.B 111.76,34.29 107.95,30.48 106.68,30.48 | 106.68,30.48 R25.1 | Q2.3 106.68,30.48
N$27
  Top 0.305: R18.1 R19.2
N$28
  Top 0.305: C21.1 R26.2 R28.2
  Bottom 0.305: IC1.2 R26.2
N$29
  Top 0.305: R19.1 72.39,40.64 72.39,38.1 73.66,36.83 77.47,36.83 78.74,38.1 78.74,39.37 92.71,53.34 104.14,53.34 R8.1 106.68,54.61 106.68,58.42 110.49,62.23 JP1.2 113.41,66.42 116.59,66.42 116.84,66.17 116.84,64.77 118.64,62.97 JP2.1
OT  (via drill 0.5)
  Top 0.254: IC1.7 90.17,43.18 R14.2
  Top 0.305: v80.01,29.21 76.2,25.4 71.12,25.4 | v80.01,35.56 82.55,38.1 v82.55,39.37 | D8.K 38.1,39.37 40.64,36.83 43.18,36.83 | v48.26,30.48 48.26,27.94 52.07,27.94 52.07,25.4 71.12,25.4 | 71.12,25.4 R35.1 | M2.2 53.98,50.16 50.8,46.99 v50.8,43.18 | v46.99,43.18 46.99,40.64 43.18,36.83 | 43.18,36.83 v43.18,34.29
  Bottom 0.305: v80.01,29.21 v80.01,35.56 | v82.55,39.37 88.9,39.37 IC1.7 | v43.18,34.29 43.18,31.75 44.45,30.48 v48.26,30.48 | v50.8,43.18 v46.99,43.18
PS_PWM
  Top 0.61: 33.02,63.5 22.86,63.5 22.86,44.45 U$1.D3
  Top 1.016: C2.- 33.02,63.5 C7.+
RAW
  Bottom 1.016: JP5.2 7.62,29.21 U$1.RAW 17.78,24.13 17.78,16.51 CN1.PWR
SCK
  Top 0.305: U$1.D13 3.81,67.31 2.54,66.04 2.54,57.15 J1.3
SCL  (via drill 0.5)
  Top 0.305: v5.08,39.37 2.54,39.37 1.27,38.1 1.27,8.89 17.78,8.89 21.59,5.08 21.59,4.01 U2.SCL
  Bottom 0.61: J2.3 v5.08,39.37 6.35,40.64 6.35,41.91 7.62,43.18 7.62,45.72 8.89,46.99 U$1.A5
SDA
  Top 0.61: U$1.A4 7.62,49.53 6.35,48.26 6.35,43.18 5.08,41.91 J2.2
  Bottom 0.305: J2.2 3.56,41.66 1.27,39.37 1.27,8.89 15.24,8.89 19.54,4.59 U2.SDA
V_IREF  (via drill 0.5)
  Top 0.305: R12.1 R13.1 | R16.1 R13.1 | R13.1 R17.2 41.91,46.99 C16.1 | v52.07,44.45 80.01,44.45 83.82,48.26 83.82,54.61 82.55,55.88 82.55,58.42 83.82,59.69 83.82,63.5 | C6.1 83.82,63.5 | 83.82,63.5 M1.3
  Bottom 0.305: C16.1 v52.07,44.45
V_IREF_SWD
  Top 0.406: M1.1 R4.2 M3.3
V_IREF_SWD_F  (via drill 0.5)
  Top 0.305: C13.1 88.9,57.15 v90.17,55.88 | v90.17,48.26 91.44,46.99 91.44,34.29 IC1.3
  Top 0.406: R4.1 C13.1
  Bottom 0.305: v90.17,55.88 v90.17,48.26
V_ISENSE
  Top 0.305: R31.2 67.31,19.05 67.31,3.81 68.58,2.54 85.09,2.54 85.98,3.43 89.41,3.43 91.06,5.08 102.87,5.08 102.87,11.43 R45.1 | R28.1 95.25,21.59 101.6,15.24 101.6,12.7
  Top 0.61: 100.33,12.7 101.6,12.7 R44.1
  Top 1.778: 102.87,12.7 102.87,16.51 105.41,19.05 111.76,19.05 114.3,21.59 Q1.E
  pour Top: 90.17,10.16 115.57,10.16 115.57,13.97 90.17,13.97
VDRV
  Top 0.305: D9.A 87.63,22.86 C21.2
  Top 0.61: R26.1 C21.2 88.9,25.4 93.98,25.4 R27.2 R25.2
  Bottom 0.61: IC1.1 R26.1
VDUT_OP
  Top 0.305: R20.2 IC2.7 48.26,33.02 45.72,30.48 40.64,30.48 39.37,31.75 R23.1

### Text on the board
tPlace: - SNS + | - DUT + | POWER
tNames: J1 | OVER / TEMP | CURRENT / ERROR
_tNames: D1 | D2 | U1 | C1 | C3 | C4 | D3 | JP2 | JP1 | C2 | R1 | C5 | M1 | C6 | C7 | C9 | C10 | C8 | C11 | JP3 | C13 | R5 | R6 | C12 | D4 | R3 | R4 | D5 | R7 | C14 | R9 | M3 | R12 | M4 | R11 | R8 | R2 | JP4 | C15 | R10 | R13 | M2 | D6 | R15 | R14 | J2 | C16 | R16 | R18 | R19 | D7 | D_TEMPSNS | R17 | R20 | R21 | R22 | C17 | C18 | D8 | Q1 | R23 | JP5 | C19 | C20 | IC1 | R25 | R24 | R26 | Q2 | R27 | IC2 | C21 | R29 | D9 | R30 | R31 | R28 | HS1 | C23 | R34 | C22 | R33 | R32 | Q3 | R40 | R41 | R42 | R43 | R44 | R45 | R47 | R48 | R49 | R38 | R37 | R46 | LED2 | R35 | R36 | LED1 | S1 | R39 | S2 | LED3 | LED4 | R50 | GLOBAL
_bNames: D100 | CN1